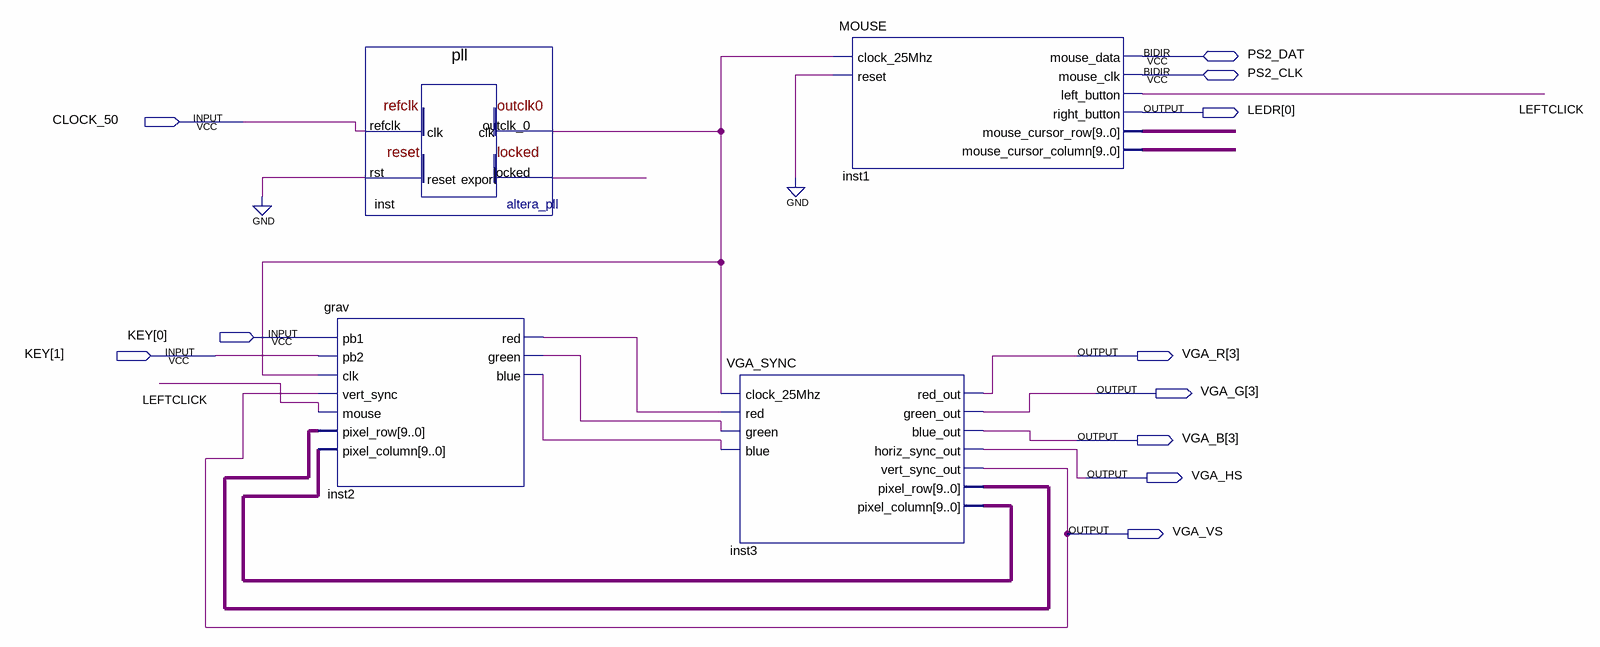
[diagram p0: schematic sheet]
// Quartus schematic game.bdf as structural Verilog: 4 symbols, 11 pins
module game (
  input  CLOCK_50,
  input  [1:0] KEY,
  inout  PS2_DAT,
  inout  PS2_CLK,
  output [0:0] LEDR,
  output [3:3] VGA_R,
  output [3:3] VGA_G,
  output [3:3] VGA_B,
  output VGA_HS,
  output VGA_VS
);

  wire inst2_blue, inst2_green, inst2_red, inst_locked, inst_outclk_0, LEFTCLICK;
  wire [9:0] inst1_mouse_cursor_column, inst1_mouse_cursor_row, inst3_pixel_column, inst3_pixel_row;

  grav inst2 (
    .pb1(KEY[0]), .pb2(KEY[1]), .clk(inst_outclk_0), .vert_sync(VGA_VS), .mouse(LEFTCLICK),
    .pixel_row(inst3_pixel_row), .pixel_column(inst3_pixel_column), .red(inst2_red), .green(inst2_green),
    .blue(inst2_blue));
  pll inst (.refclk(CLOCK_50), .rst(1'b0), .outclk_0(inst_outclk_0), .locked(inst_locked));
  VGA_SYNC inst3 (
    .clock_25Mhz(inst_outclk_0), .red(inst2_red), .green(inst2_green), .blue(inst2_blue), .red_out(VGA_R[3]),
    .green_out(VGA_G[3]), .blue_out(VGA_B[3]), .horiz_sync_out(VGA_HS), .vert_sync_out(VGA_VS),
    .pixel_row(inst3_pixel_row), .pixel_column(inst3_pixel_column));
  MOUSE inst1 (
    .clock_25Mhz(inst_outclk_0), .reset(1'b0), .left_button(LEFTCLICK), .right_button(LEDR[0]),
    .mouse_cursor_row(inst1_mouse_cursor_row), .mouse_cursor_column(inst1_mouse_cursor_column),
    .mouse_data(PS2_DAT), .mouse_clk(PS2_CLK));
endmodule
